# EAGLE schematic lights_board (EAGLE 8.2.0)
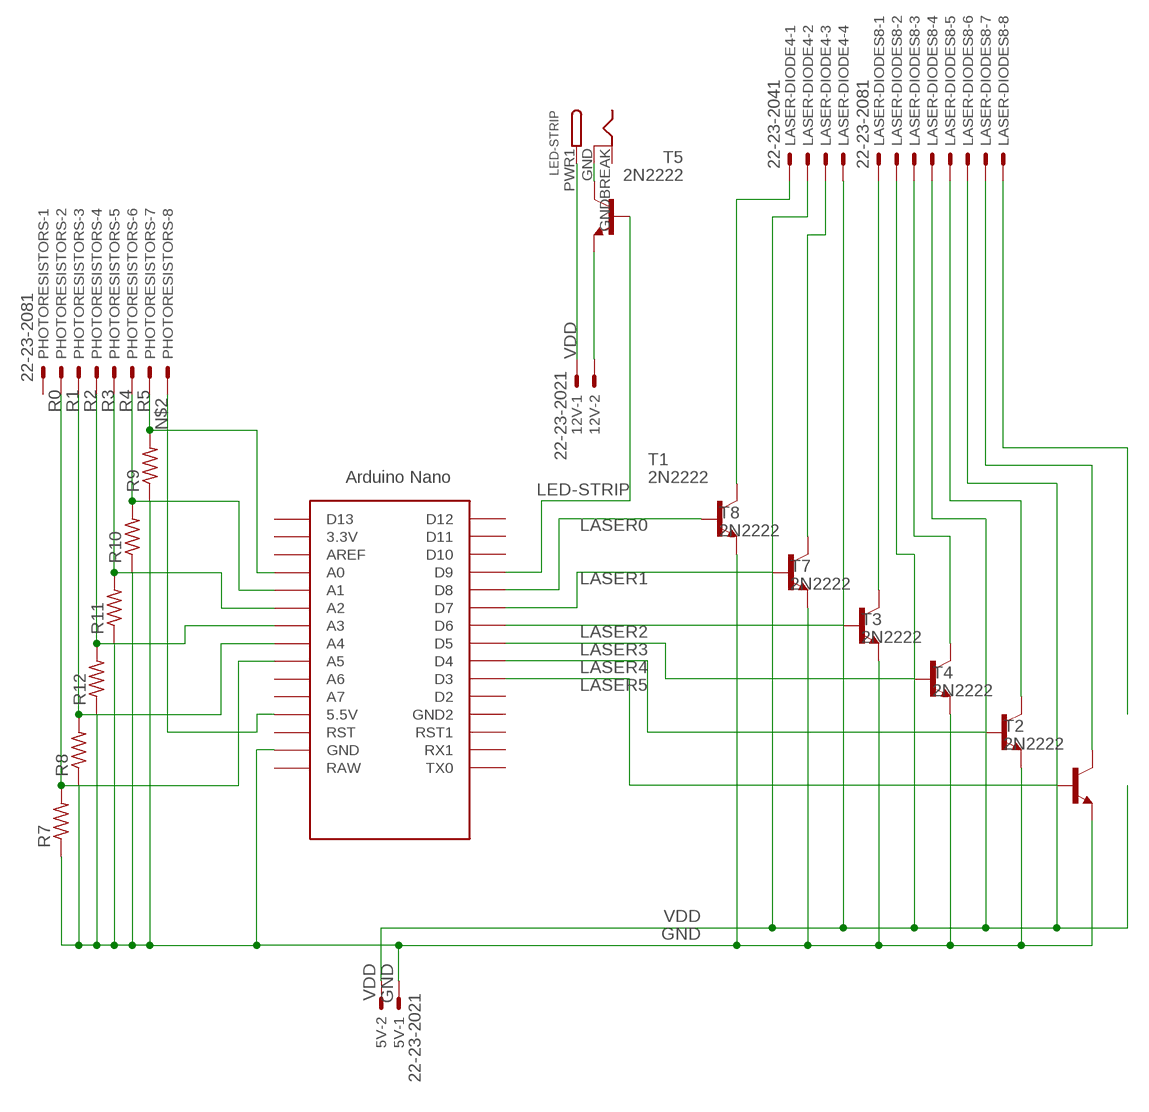
[diagram p0: schematic, sheet 1]

## Parts
5V  22-23-2021  [22-23-2021]
12V  22-23-2021  [22-23-2021]
LASER-DIODE4  22-23-2041  [22-23-2041]
LASER-DIODES8  22-23-2081  [22-23-2081]
LED-STRIP  DCBARRELSMT  [DCJACK_2MM_SMT]
PHOTORESISTORS  22-23-2081  [22-23-2081]
R7  R-US_0207/2V  [0207/2V]
R8  R-US_0207/2V  [0207/2V]
R9  R-US_0207/2V  [0207/2V]
R10  R-US_0207/2V  [0207/2V]
R11  R-US_0207/2V  [0207/2V]
R12  R-US_0207/2V  [0207/2V]
T1  2N2222  [TO92-EBC-OVAL]
T2  2N2222  [TO92-EBC-OVAL]
T3  2N2222  [TO92-EBC-OVAL]
T4  2N2222  [TO92-EBC-OVAL]
T5  2N2222  [TO92-EBC-OVAL]
T7  2N2222  [TO92-EBC-OVAL]
T8  2N2222  [TO92-EBC-OVAL]
U$1  NANO  [NANO]

## Nets
GND: 5V.1 LED-STRIP.GND(GNDBREAK) R7.1 R8.1 R9.1 R10.1 R11.1 R12.1 T1.E T2.E T3.E T4.E T5.C T7.E T8.E U$1.GND
LASER0: T1.B U$1.D8
LASER1: T8.B U$1.D7
LASER2: T7.B U$1.D6
LASER3: T3.B U$1.D5
LASER4: T4.B U$1.D4
LASER5: T2.B U$1.D3
LED-STRIP: T5.B U$1.D9
N$2: PHOTORESISTORS.8 U$1.5V(5.5V)
N$4: 12V.2 T5.E
N$18: LASER-DIODE4.1 T1.C
N$20: LASER-DIODE4.3 T8.C
N$22: LASER-DIODES8.1 T7.C
N$24: LASER-DIODES8.3 T3.C
N$26: LASER-DIODES8.5 T4.C
N$28: LASER-DIODES8.7 T2.C
N$29: LASER-DIODES8.8
R0: PHOTORESISTORS.2 R7.2 U$1.A5
R1: PHOTORESISTORS.3 R8.2 U$1.A4
R2: PHOTORESISTORS.4 R12.2 U$1.A3
R3: PHOTORESISTORS.5 R11.2 U$1.A2
R4: PHOTORESISTORS.6 R10.2 U$1.A1
R5: PHOTORESISTORS.7 R9.2 U$1.A0
VDD: 5V.2 12V.1 LASER-DIODE4.2 LASER-DIODE4.4 LASER-DIODES8.2 LASER-DIODES8.4 LASER-DIODES8.6 LED-STRIP.PWR1(PWR)
Unconnected: PHOTORESISTORS.1 U$1.3.3V U$1.A6 U$1.A7 U$1.AREF U$1.D2 U$1.D10 U$1.D11 U$1.D12 U$1.D13 U$1.GND1(GND2) U$1.ICSP1 U$1.ICSP2 U$1.ICSP3 U$1.ICSP4 U$1.ICSP5 U$1.ICSP6 U$1.RAW U$1.RST U$1.RST1 U$1.RX1 U$1.TX0

## Power pins joined to a net without a drawn wire
GND: LED-STRIP.GNDBREAK(GND)

## Library data of the parts
5V 12V = con-molex:22-23-2021: .100" (2.54mm) Center Header - 2 Pin; MF: MOLEX; MPN: 22-23-2021; OC_FARNELL: 1462926; OC_NEWARK: 25C3832
LASER-DIODE4 = con-molex:22-23-2041: .100" (2.54mm) Center Header - 4 Pin; MF: MOLEX; MPN: 22-23-2041; OC_FARNELL: 1462920; OC_NEWARK: 38C0355
LASER-DIODES8 PHOTORESISTORS = con-molex:22-23-2081: .100" (2.54mm) Center Header - 8 Pin; MF: MOLEX; MPN: 22-23-2081; OC_FARNELL: 1756826; OC_NEWARK: 01C7592
LED-STRIP = adafruit:DCBARREL: 2.0mm DC Barrel Jack DCJACK_2MM_PTH - Through Hole Jack (4UConnector: 05537)
R7-R12 = adafruit:R-US_: RESISTOR, American symbol
T1-T5 T7 T8 = adafruit:2N2222: NPN TRANSISTOR Big oval pads
U$1 = Arduino-clone:NANO: Arduino Nano